# Altium project EMGfrontend.PrjPcb
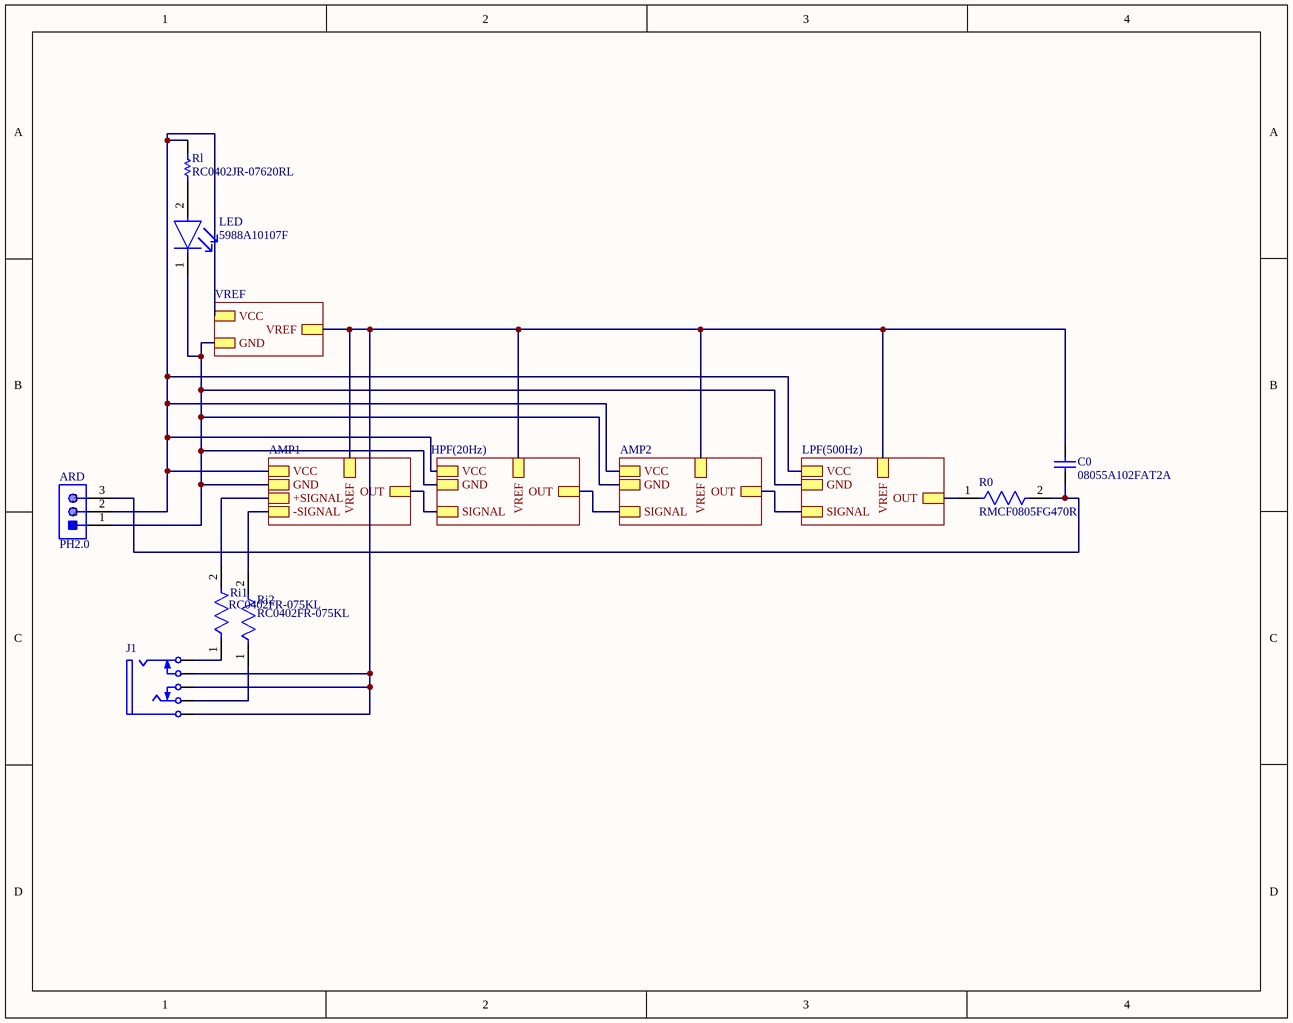
[diagram p0: EMGfrontend.SchDoc]
6 sheets, 29 parts. Net scope: hierarchical (ports join the sheet entries above them; power ports are global).
Board file: EMGfrontend.PcbDoc
Sheets:
  EMGfrontend.SchDoc
    VREF = VREF.SchDoc
    AMP2 = AMP2.SchDoc
    LPF(500Hz) = LPF(500Hz).SchDoc
    AMP1 = AMP1.SchDoc
    HPF(20Hz) = HPF(20Hz).SchDoc

## Sheet EMGfrontend.SchDoc
size A; SheetNumber: 1; SheetTotal: 6

### Parts
ARD  PH2.0  [JST-B3B-PH-K-S-3_V]
C0  08055A102FAT2A  [CAPC2013X94X50NL20T25]
J1  (no value)  [SWIT-35RASMT4BHNTRX_V]
LED  5988A10107F  [FP-5988A10107F-MFG]
R0  RMCF0805FG470R  [FP-RMCF0805-IPC_C]
Ri1  RC0402FR-075KL  [FP-RC0402-MFG]
Ri2  RC0402FR-075KL  [FP-RC0402-MFG]
Rl  RC0402JR-07620RL  [RESC1005X40X25ML05T10]

### Sub-sheets
AMP1 = AMP1.SchDoc: VREF, +SIGNAL, OUT, GND, VCC, -SIGNAL
AMP2 = AMP2.SchDoc: VREF, SIGNAL, VCC, GND, OUT
HPF(20Hz) = HPF(20Hz).SchDoc: SIGNAL, VREF, OUT, VCC, GND
LPF(500Hz) = LPF(500Hz).SchDoc: SIGNAL, VCC, GND, VREF, OUT
VREF = VREF.SchDoc: VREF, VCC, GND

### Nets
NetARD_1: ARD.1 LED.1(C) ; sheet VREF/GND, sheet AMP2/GND, sheet LPF(500Hz)/GND, sheet AMP1/GND, sheet HPF(20Hz)/GND
NetARD_2: ARD.2 Rl.2 ; sheet VREF/VCC, sheet AMP2/VCC, sheet LPF(500Hz)/VCC, sheet AMP1/VCC, sheet HPF(20Hz)/VCC
NetARD_3: ARD.3 C0.1 R0.2
NetC0_2: C0.2 J1.1 J1.4 J1.5 ; sheet VREF/VREF, sheet AMP2/VREF, sheet LPF(500Hz)/VREF, sheet AMP1/VREF, sheet HPF(20Hz)/VREF
NetC3_1: sheet AMP1/OUT, sheet HPF(20Hz)/SIGNAL
NetC4_2: R0.1 ; sheet LPF(500Hz)/OUT
NetJ1_2: J1.2 Ri1.1
NetJ1_3: J1.3 Ri2.1
NetLED_2: LED.2(A) Rl.1
NetR5_2: sheet AMP2/SIGNAL, sheet HPF(20Hz)/OUT
NetR7_2: sheet AMP2/OUT, sheet LPF(500Hz)/SIGNAL
NetRi1_2: Ri1.2 ; sheet AMP1/+SIGNAL
NetRi2_2: Ri2.2 ; sheet AMP1/-SIGNAL

### Library data of the parts
ARD = CMP-2000-05164-1: Male Header, Pitch 2 mm, 1 x 3 Position, Height 6 mm, Tail Length 3.4 mm, -25 to 85 degC, RoHS, Bulk; Manufacturer: JST; Style/Orientation: StraightHeader/Plug; Pitch: 2mm; No of Positions: 3; Termination: Crimp; Manufacturer URL: http://www.jst.com/home2.html; Datasheet Version: Oct-06; Type: ShroudedHeader; Datasheet URL: https://datasheet.ciiva.com/11746/0900766b80826550-11746939.pdf
C0 = CMP-2007-04267-1: Manufacturer: AVX Interconnect / Elco; Part Number: 08055A102FAT2A
J1 = CMP-1772-00001-1: Female 3.5 mm Phone Jack, 5 Position, Height 5 mm, RoHS, Tape and Reel; Current Rating: 50 mA; Voltage Rating (DC): 12 V; ComponentLink1URL: http://www.switchcraft.com/; ComponentLink2Description: Datasheet; ComponentLink2URL: http://www.switchcraft.com/Drawings/35rasmt4bhntrx_cd.pdf; PackageDescription: Female 3.5 mm Phone Jack, 5 Position, Height 5 mm; PackageReference: 35RASMT4BHNTRX; Mount: Through Hole; DatasheetVersion: Rev. C, 07/2014; Contact Material: Silver; ComponentLink1Description: Manufacturer URL; Packaging: Tape and Reel; RoHSCompliant: true; Contact Plating: Silver; Package Quantity: 3000
LED = CMP-00106-100993512-1: 5988A10107F LED Uni-Color Red 2-Pin Chip 0402(1006Metric) T/R; Forward Voltage: 1.6V; Forward Current: 5mA; Power Dissipation: 46mW; Reverse Voltage: 5V; Luminous Intensity: 65mcd; Viewing Angle: 140°; Wavelength: 635nm; Max Operating Temperature: 85°C; Case/Package: 0402; Color: Red; Height: 533.4µm; NexarPartId: 100993512; RoHS: Compliant; Schedule B: 8541402000, 8541402000; Min Operating Temperature: -40°C
R0 = CMP-26527-003746-1: 470Ω ±1% 0.125W 0805 Thick Film Chip Resistor AEC-Q200 compliant; Resistance: 470R; Temperature Coefficient: 100ppm/°C; Max Power Dissipation: 125mW; Resistor Type: Thick Film; Number of Terminations: 2; Packaging: Tape and Reel; RoHS Compliant: Yes; Case/Package: 0805; Mount: Surface Mount; Contact Plating: Tin; Series: RMCF; Min Operating Temperature: -55°C; Radiation Hardening: No; Features: Automotive AEC-Q200; Tolerance: 1%; Max Operating Temperature: 155°C
Ri1 Ri2 = CMP-03412-013078-1: RES SMD 5K OHM 1% 1/16W 0402; Manufacturer: Yageo; Resistance: 5kΩ; Temperature Coefficient: 100ppm/°C; Power Rating: 0.0625W; Voltage Rating: 50V; Value: 5kΩ; Temperature Range Low: -55°C; Lead Free: Yes; RoHS: TRUE; Device Class L2: Resistors; Package: RC0402; Footprint Url: https://pccomponents.com/datasheets/YAGEO-20RESISTORS.PDF; Height: 0.4mm; ComponentLink2URL: http://www.yageo.com/documents/recent/PYu-RC_Group_51_RoHS_L_10.pdf; Temperature: -55°C to +155°C; Composition: Thick Film; Device Class L1: Passive Components; Series: RC_L; Ipc Land Pattern Name: RESC10050X35; Tolerance: 1%; Device Class L3: Chip SMD Resistors; Temperature Range High: +155°C; Category: Res; Automotive: No; Octopart: https://octopart.com/rc0402fr-075kl-yageo-25450038; Digikey Description: RES SMD 5K OHM 1% 1/16W 0402; ComponentLink2Description: Datasheet; Manufacturer Part Number: RC0402FR-075KL
Rl = CMP-2002-07079-1: Manufacturer: Yageo / Phycomp; Part Number: RC0402JR-07620RL

## Sheet VREF.SchDoc
size A; SheetNumber: 2; SheetTotal: 6
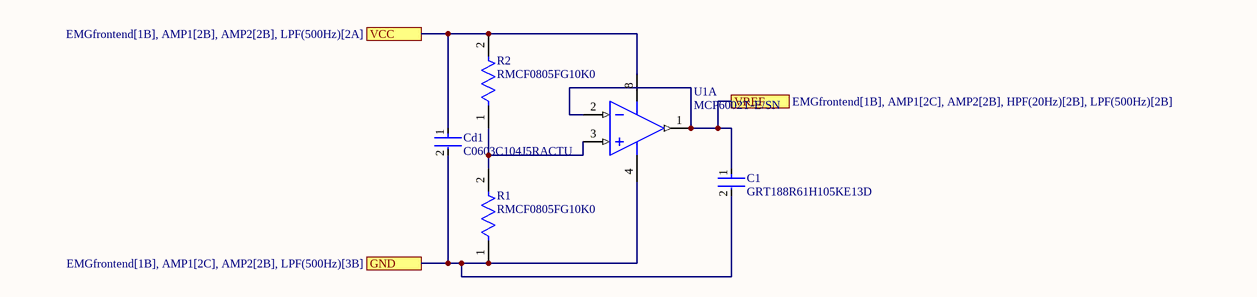
[diagram p1: VREF.SchDoc]

### Parts
C1  GRT188R61H105KE13D  [FP-GRT188-0_1-e0_2_0_5-IPC_B]
Cd1  C0603C104J5RACTU  [FP-C0603C-CF-MFG]
R1  RMCF0805FG10K0  [FP-RMCF0805-IPC_A]
R2  RMCF0805FG10K0  [FP-RMCF0805-IPC_A]
U1  MCP6002T-E/SN  [SOIC-SN8_N]  (part A of 2)

### Ports
GND (see EMGfrontend[1B], AMP1[2C], AMP2[2B], LPF(500Hz)[3B]), VCC (see EMGfrontend[1B], AMP1[2B], AMP2[2B], LPF(500Hz)[2A]), VREF (see EMGfrontend[1B], AMP1[2C], AMP2[2B], HPF(20Hz)[2B], LPF(500Hz)[2B])

### Nets
NetARD_1: C1.2 Cd1.2 R1.1 U1.4(VSS) ; port GND
NetARD_2: Cd1.1 R2.2 U1.8(VDD) ; port VCC
NetC0_2: C1.1 U1.1(VOUTA) U1.2(VINA-) ; port VREF
NetR1_2: R1.2 R2.1 U1.3(VINA+)

### Library data of the parts
C1 = CMP-06035-031856-1: Multi-Layer Ceramic Capacitor 1uF 50V X5R ±10% 0603 Paper T/R; Voltage Rating (DC): 50V; Voltage Rating: 50V; Min Operating Temperature: -55°C; Case Code (Metric): 1608; Thickness: 0.035inch; Width: 0.031inch; Capacitance: 1uF; Tolerance: 10%; Max Operating Temperature: 85°C; Dielectric: X5R; Case Code (Imperial): 0603; Case/Package: 0603; Length: 0.063inch; Packaging: Tape and Reel; Mount: Surface Mount; Ratings: AEC-Q200
Cd1 = CMP-2006-03056-2: CAP CER 0.1UF 50V 5% X7R 0603; Manufacturer: KEMET; Automotive Grade: Grade 1; Tolerance: 0.05; Capacitance: 0.10 μF; Value: 0.10 μF; Temperature Coefficient: 30ppm/°C; ComponentLink2Description: Datasheet; Voltage Rating: 50 V; Digikey Description: CAP CER 0.1UF 50V 5% X7R 0603; Manufacturer Part Number: C0603C104J5RACTU; Temperature Range High: +125°C; Device Class L2: Capacitors; Octopart: https://octopart.com/c0603c104j5ractu-kemet-10440638; RoHS: TRUE; Mouser Description: Multilayer Ceramic Capacitors MLCC - SMD/SMT 50volts 0.1uF X7R 5%; Temperature Range Low: -55°C; Automotive: Yes; Lead Free: Yes; ComponentLink2URL: https://api.kemet.com/component-edge/download/datasheet/C0603C100J5GACAUTO.pdf; Material: Ceramic; Device Class L3: Ceramic Capacitors; Package: C0603C-CF; Category: Cap; Temperature: -55°C to +125°C; Height: 0.87mm; Temperature Characteristic: X7R; Device Class L1: Passive Components
R1 R2 = CMP-26527-002739-1: 10kΩ ±1% 0.125W 0805 Thick Film Chip Resistor AEC-Q200 compliant; Resistance: 10kR; Max Power Dissipation: 125mW; Temperature Coefficient: 100ppm/°C; Construction: Rectangular; Case/Package: 0805; Contact Plating: Tin; RoHS Compliant: Yes; Mount: Surface Mount; Case Code (Metric): 2012; Radiation Hardening: No; Packaging: Tape and Reel; Case Code (Imperial): 0805; Tolerance: 1%; Max Operating Temperature: 155°C; Length: 0.079inch; Min Operating Temperature: -55°C; Features: Automotive AEC-Q200; Width: 0.049inch; Height: 0.026inch; Depth: 1.25mm; Number of Terminations: 2; Resistor Type: Thick Film; Series: RMCF; Military Standard: Not
U1 = CMP-0187-00363-3: None; Nominal Supply Current: 100uA; Operating Supply Voltage: 5.5V; Input Bias Current: 1pA; Output Current per Channel: 23mA; Unity Gain Bandwidth Product: 1MHz; Number of Elements: 2; Power Supply Rejection Ratio (PSRR): 86dB; Slew Rate: 0.6V/µs; Min Supply Voltage: 1.8V; Voltage Gain: 112dB; Max Supply Voltage: 6V; Input Offset Voltage (Vos): 4.5mV; Common Mode Rejection Ratio: 60dB; Amplifier Type: GENERAL PURPOSE; Technology: CMOS; Output Current: 23mA; Number of Pins: 8; Lead Free: Lead Free; Number of Channels: 2; Package Quantity: 3300; Max Operating Temperature: 125°C; Number of Circuits: 2; Supply Current: 100uA; Gain Bandwidth Product: 1MHz; Min Operating Temperature: -40°C; Series: -; Mount: Surface Mount; Case/Package: SOIC; Radiation Hardening: No; Packaging: Tape and Reel; Operating Supply Current: 100uA; RoHS Compliant: Yes

## Sheet AMP2.SchDoc
size A; SheetNumber: 5; SheetTotal: 6
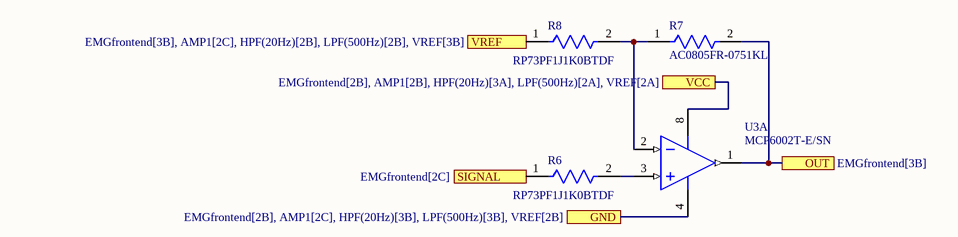
[diagram p2: AMP2.SchDoc]

### Parts
R6  RP73PF1J1K0BTDF  [FP-RP73P-1J-MFG]
R7  AC0805FR-0751KL  [FP-AC0805-MFG]
R8  RP73PF1J1K0BTDF  [FP-RP73P-1J-MFG]
U3  MCP6002T-E/SN  [SOIC-SN8_N]  (part A of 2)

### Ports
GND (see EMGfrontend[2B], AMP1[2C], HPF(20Hz)[3B], LPF(500Hz)[3B], VREF[2B]), OUT (see EMGfrontend[3B]), SIGNAL (see EMGfrontend[2C]), VCC (see EMGfrontend[2B], AMP1[2B], HPF(20Hz)[3A], LPF(500Hz)[2A], VREF[2A]), VREF (see EMGfrontend[3B], AMP1[2C], HPF(20Hz)[2B], LPF(500Hz)[2B], VREF[3B])

### Nets
NetARD_1: U3.4(VSS) ; port GND
NetARD_2: U3.8(VDD) ; port VCC
NetC0_2: R8.1 ; port VREF
NetR5_2: R6.1 ; port SIGNAL
NetR6_2: R6.2 U3.3(VINA+)
NetR7_1: R7.1 R8.2 U3.2(VINA-)
NetR7_2: R7.2 U3.1(VOUTA) ; port OUT

### Library data of the parts
R6 R8 = CMP-03211-004517-1: RES SMD 1K OHM 0.1% 1/6W 0603; Manufacturer: TE Connectivity; Value: 1KΩ; Power Rating: 0.166W; Tolerance: 0.001; Temperature Coefficient: 25ppm/°C; Description: RP73P 0603 1KΩ 0.166W 25ppm/°C 0.10% 100V; Voltage Rating: 100V; Composition: Thin Film; Category: Res; Temperature Range High: +155°C; Device Class L1: Passive Components; Digikey Description: RES SMD 1K OHM 0.1% 1/6W 0603; Lead Free: Yes; RoHS: TRUE; Ipc Land Pattern Name: RESC15580X45; Automotive: No; Temperature: -55°C to +155°C; Height: 0.55mm; ComponentLink2URL: https://www.te.com/commerce/DocumentDelivery/DDEController?Action=srchrtrv&DocNm=1773272&DocType=DS&DocLang=English; Manufacturer Part Number: RP73PF1J1K0BTDF; Resistance: 1KΩ; ComponentLink2Description: Datasheet; Temperature Range Low: -55°C; Octopart: https://octopart.com/rp73pf1j1k0btdf-te+connectivity-45465729; Device Class L3: Chip SMD Resistors; Series: RP73P; Package: RP73P-1J; Device Class L2: Resistors
R7 = CMP-03412-037324-1: RES SMD 51K OHM 1% 1/8W 0805; Manufacturer: Yageo; Voltage Rating: 150V; Automotive Grade: Grade 0; Resistance: 51KΩ; Tolerance: 0.01; Value: 51KΩ; Device Class L3: Chip SMD Resistors; Category: Res; Composition: Thick Film; Device Class L1: Passive Components; ComponentLink2Description: Datasheet; Manufacturer Part Number: AC0805FR-0751KL; Temperature: -55°C to +155°C; Height: 0.6mm; Package: AC0805; ComponentLink2URL: http://www.yageo.com/documents/recent/PYu-AC_51_RoHS_L_6.pdf; Mouser Description: Thick Film Resistors - SMD 1/8W 51K ohm 1%; Lead Free: Yes; Digikey Description: RES SMD 51K OHM 1% 1/8W 0805; RoHS: TRUE; Device Class L2: Resistors; Octopart: https://octopart.com/ac0805fr-0751kl-yageo-24874955; Ipc Land Pattern Name: RESC200125X50; Temperature Range Low: -55°C; Footprint Url: http://www.yageo.com/exep/pages/download/literatures/PYu-R_Mount_10.pdf; Series: AC; Automotive: Yes; Power Rating: 1/8W; Temperature Range High: +155°C
U3 = CMP-0187-00363-3: as U1 on sheet VREF; Technology: CMOS; Output Current: 23mA; Number of Pins: 8; Lead Free: Lead Free; Number of Channels: 2; Package Quantity: 3300; Max Operating Temperature: 125°C; Number of Circuits: 2; Supply Current: 100uA; Gain Bandwidth Product: 1MHz; Min Operating Temperature: -40°C; Series: -; Mount: Surface Mount; Case/Package: SOIC; Radiation Hardening: No; Packaging: Tape and Reel; Operating Supply Current: 100uA; RoHS Compliant: Yes

## Sheet LPF(500Hz).SchDoc
size A; SheetNumber: 6; SheetTotal: 6
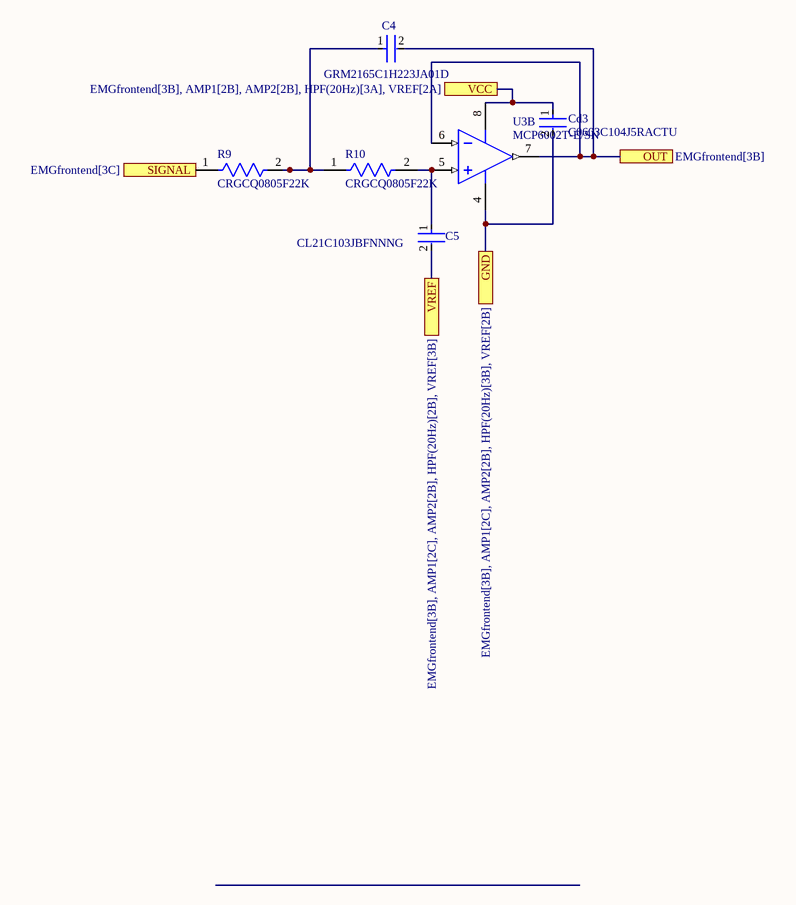
[diagram p3: LPF(500Hz).SchDoc]

### Parts
C4  GRM2165C1H223JA01D  [FP-GRM216-0_1-0_05-MFG]
C5  CL21C103JBFNNNG  [FP-CL21-IPC_B]
Cd3  C0603C104J5RACTU  [FP-C0603C-CF-MFG]
R9  CRGCQ0805F22K  [FP-CRGCQ0805-IPC_C]
R10  CRGCQ0805F22K  [FP-CRGCQ0805-IPC_C]
U3  MCP6002T-E/SN  [SOIC-SN8_N]  (part B of 2)

### Ports
GND (see EMGfrontend[3B], AMP1[2C], AMP2[2B], HPF(20Hz)[3B], VREF[2B]), OUT (see EMGfrontend[3B]), SIGNAL (see EMGfrontend[3C]), VCC (see EMGfrontend[3B], AMP1[2B], AMP2[2B], HPF(20Hz)[3A], VREF[2A]), VREF (see EMGfrontend[3B], AMP1[2C], AMP2[2B], HPF(20Hz)[2B], VREF[3B])

### Nets
NetARD_1: Cd3.2 U3.4(VSS) ; port GND
NetARD_2: Cd3.1 U3.8(VDD) ; port VCC
NetC0_2: C5.2 ; port VREF
NetC4_1: C4.1 R9.2 R10.1
NetC4_2: C4.2 U3.6(VINB-) U3.7(VOUTB) ; port OUT
NetC5_1: C5.1 R10.2 U3.5(VINB+)
NetR7_2: R9.1 ; port SIGNAL

### Library data of the parts
C4 = CMP-06035-050815-1: 22000pF
C5 = CMP-13271-003702-1: 10nF; Voltage Rating: 50V; Dielectric: C0G; Tolerance: 5%; Temperature Coefficient: 300ppm/°C; Packaging: Tape and Reel; Package Quantity: 3000; Case Code (Imperial): 0805; Mount: Surface Mount; Max Operating Temperature: 125°C; Case Code (Metric): 2012; Width: 0.049inch; Thickness: 0.053inch; Depth: 1.25mm; Case/Package: 0805; Capacitance: 10nF; Min Operating Temperature: -55°C; Voltage: 50V; Length: 2mm; Height: 1.25mm; Radiation Hardening: No
Cd3 = CMP-2006-03056-2: as Cd1 on sheet VREF; ComponentLink2Description: Datasheet; Voltage Rating: 50 V; Digikey Description: CAP CER 0.1UF 50V 5% X7R 0603; Manufacturer Part Number: C0603C104J5RACTU; Temperature Range High: +125°C; Device Class L2: Capacitors; Octopart: https://octopart.com/c0603c104j5ractu-kemet-10440638; RoHS: TRUE; Mouser Description: Multilayer Ceramic Capacitors MLCC - SMD/SMT 50volts 0.1uF X7R 5%; Temperature Range Low: -55°C; Automotive: Yes; Lead Free: Yes; ComponentLink2URL: https://api.kemet.com/component-edge/download/datasheet/C0603C100J5GACAUTO.pdf; Material: Ceramic; Device Class L3: Ceramic Capacitors; Package: C0603C-CF; Category: Cap; Temperature: -55°C to +125°C; Height: 0.87mm; Temperature Characteristic: X7R; Device Class L1: Passive Components
R9 R10 = CMP-03211-003824-1: CRGCQ0805 22KΩ 0.125W ±100ppm/°C 1% 150V; Manufacturer: TE Connectivity; Automotive Grade: Grade 985; Tolerance: 0.01; Temperature Coefficient: ±100ppm/°C; Octopart: https://octopart.com/crgcq0805f22k-te+connectivity-91018161; Manufacturer Part Number: CRGCQ0805F22K; Power Rating: 0.125W; Series: CRGCQ; Device Class L1: Passive Components; Composition: Thick Film; Lead Free: Yes; Ipc Land Pattern Name: RESC200125X55; ComponentLink2URL: https://www.te.com/commerce/DocumentDelivery/DDEController?Action=showdoc&DocId=Data+Sheet%7F1773204-3%7F1%7Fpdf%7FEnglish%7FENG_DS_1773204-3_1.pdf%7F4-2176341-994; Device Class L3: Chip SMD Resistors; Package: CRGCQ0805; Temperature Range Low: -55°C; Voltage Rating: 150V; Value: 22KΩ; Temperature: -55°C to +155°C; ComponentLink2Description: Datasheet; Automotive: Yes; Height: 0.65mm; Device Class L2: Resistors; RoHS: TRUE; Ambient Temperature Range High: +70°C; Temperature Range High: +155°C; Resistance: 22KΩ; Category: Res
U3 = CMP-0187-00363-3: as U1 on sheet VREF; Technology: CMOS; Output Current: 23mA; Number of Pins: 8; Lead Free: Lead Free; Number of Channels: 2; Package Quantity: 3300; Max Operating Temperature: 125°C; Number of Circuits: 2; Supply Current: 100uA; Gain Bandwidth Product: 1MHz; Min Operating Temperature: -40°C; Series: -; Mount: Surface Mount; Case/Package: SOIC; Radiation Hardening: No; Packaging: Tape and Reel; Operating Supply Current: 100uA; RoHS Compliant: Yes

## Sheet AMP1.SchDoc
size A; SheetNumber: 3; SheetTotal: 6
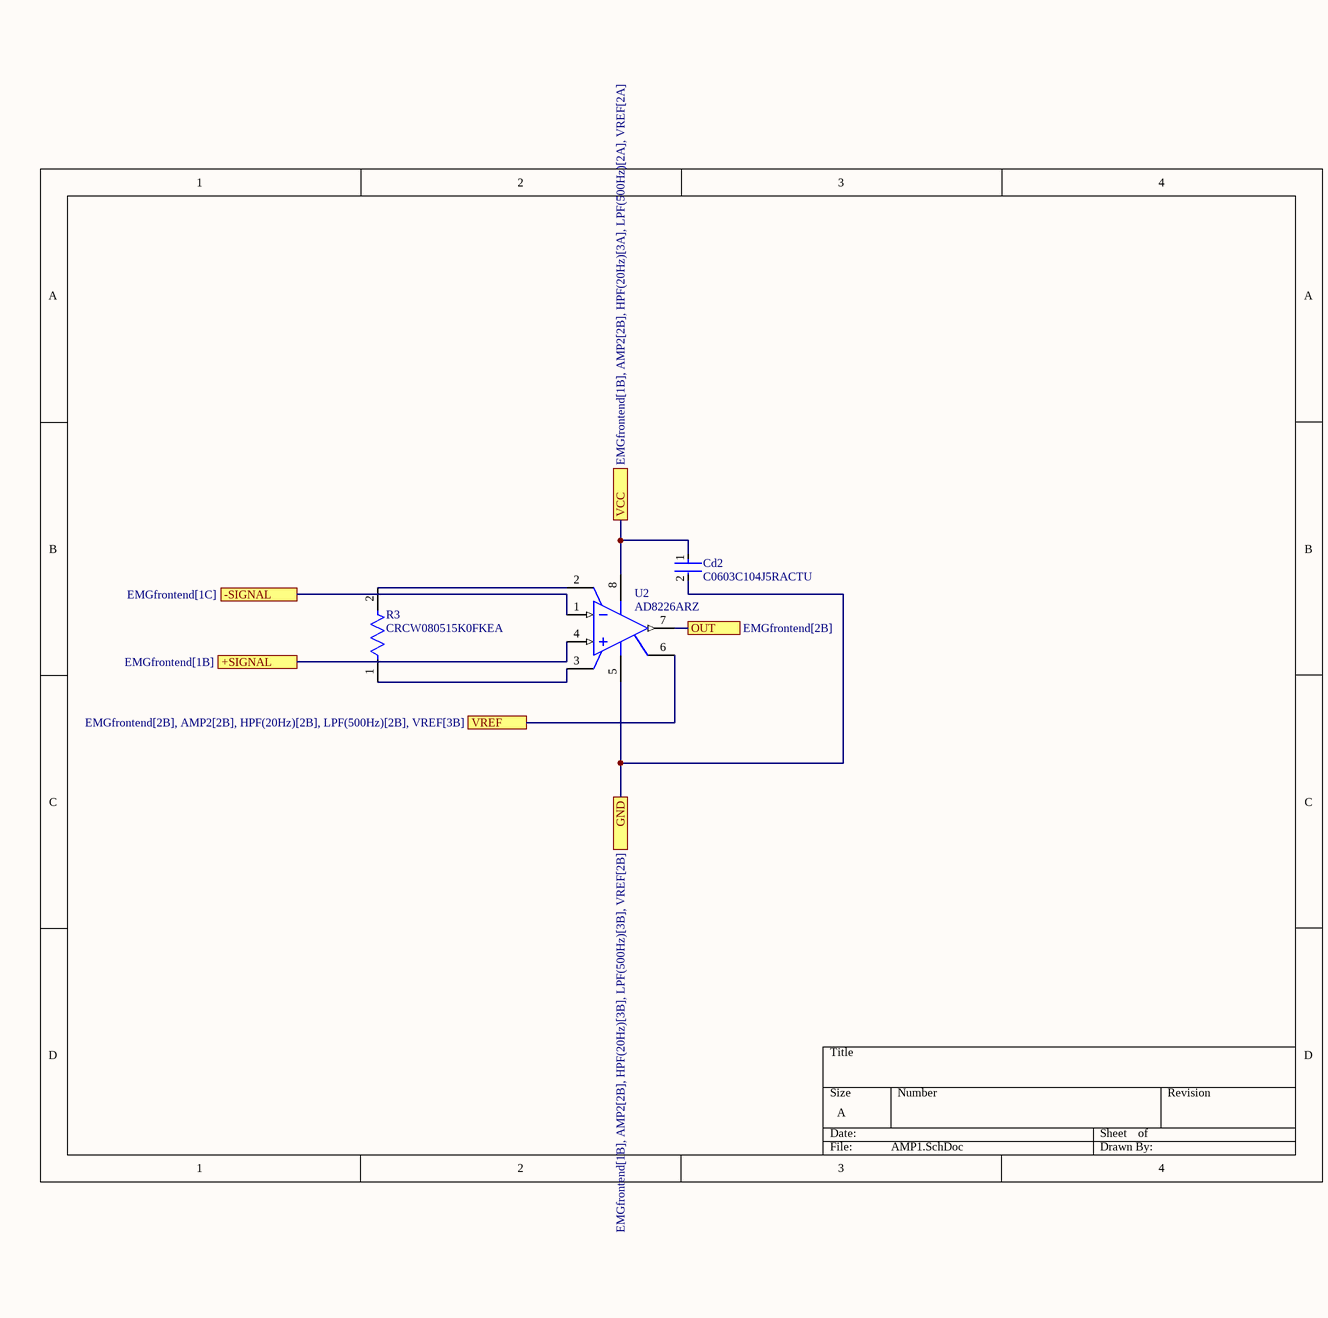
[diagram p4: AMP1.SchDoc]

### Parts
Cd2  C0603C104J5RACTU  [FP-C0603C-CF-MFG]
R3  CRCW080515K0FKEA  [FP-CRCW0805-e3-IPC_C]
U2  AD8226ARZ  [ADI-R-8_L]

### Ports
+SIGNAL (see EMGfrontend[1B]), -SIGNAL (see EMGfrontend[1C]), GND (see EMGfrontend[1B], AMP2[2B], HPF(20Hz)[3B], LPF(500Hz)[3B], VREF[2B]), OUT (see EMGfrontend[2B]), VCC (see EMGfrontend[1B], AMP2[2B], HPF(20Hz)[3A], LPF(500Hz)[2A], VREF[2A]), VREF (see EMGfrontend[2B], AMP2[2B], HPF(20Hz)[2B], LPF(500Hz)[2B], VREF[3B])

### Nets
NetARD_1: Cd2.2 U2.5(-VS) ; port GND
NetARD_2: Cd2.1 U2.8(+VS) ; port VCC
NetC0_2: U2.6(REF) ; port VREF
NetC3_1: U2.7(VOUT) ; port OUT
NetR3_1: R3.1 U2.3(RG)
NetR3_2: R3.2 U2.2(RG)
NetRi1_2: U2.4(+IN) ; port +SIGNAL
NetRi2_2: U2.1(-IN) ; port -SIGNAL

### Library data of the parts
Cd2 = CMP-2006-03056-2: as Cd1 on sheet VREF; ComponentLink2Description: Datasheet; Voltage Rating: 50 V; Digikey Description: CAP CER 0.1UF 50V 5% X7R 0603; Manufacturer Part Number: C0603C104J5RACTU; Temperature Range High: +125°C; Device Class L2: Capacitors; Octopart: https://octopart.com/c0603c104j5ractu-kemet-10440638; RoHS: TRUE; Mouser Description: Multilayer Ceramic Capacitors MLCC - SMD/SMT 50volts 0.1uF X7R 5%; Temperature Range Low: -55°C; Automotive: Yes; Lead Free: Yes; ComponentLink2URL: https://api.kemet.com/component-edge/download/datasheet/C0603C100J5GACAUTO.pdf; Material: Ceramic; Device Class L3: Ceramic Capacitors; Package: C0603C-CF; Category: Cap; Temperature: -55°C to +125°C; Height: 0.87mm; Temperature Characteristic: X7R; Device Class L1: Passive Components
R3 = CMP-2001-04967-2: RES Thick Film, 15kΩ, 1%, 0.125W, 100ppm/°C, 0805; Power Rating: 125mW; Voltage Rating: 150V; Resistance: 15kR; Height: 0.45mm; Number of Terminations: 2; Composition: Thick Film; Length: 2mm; Case/Package: 0805; Depth: 1.25mm; Min Operating Temperature: -55°C; Lead Free: Lead Free; Mount: Surface Mount; Package Quantity: 10; Termination: SMD/SMT; Packaging: Tape and Reel; Case Code (Metric): 2012; Features: Automotive AEC-Q200; Military Standard: Not; Width: 0.049inch; Temperature Coefficient: 100ppm/°C; Max Power Dissipation: 125mW; Weight: 0.000194oz; Tolerance: 1%; Voltage Rating (DC): 150V; Max Operating Temperature: 155°C; Radiation Hardening: No; Contact Plating: Tin; Case Code (Imperial): 0805
U2 = CMP-2000-05749-1: Wide Supply Range, Rail-to-Rail Output Instrumentation Amplifier, 2.2 to 36 V, -40 to 125 degC, 8-Pin SOIC (R-8), RoHS, Tube; Manufacturer: Analog Devices; PCN Design/Specification: PolyimideAlignmentTarget11/Aug/2015; Mfg Application Notes: AutomaticExternalDefibrillator(AED)SolutionsElectromagneticFlowMeterSolutionsMotorControlSolution—ServoControlProgrammableLogicControllers(PLCs)SolutionsElectrocardiogram(ECG)Solutions; EDA / CAD Models: DownloadfromAcceleratedDesigns; Design Resources: PLCandDCSUniversalAnalogInputUsingEither4or6-PinTerminalBlock; Current - Input Bias: 20nA; Product Training Modules: CommonPhotodiodeOp-AmpCircuitProblemsandSolutionsIndirectCurrentFeedbackInstrumentationAmplifierApplicationsGuide; -3db Bandwidth: 1.5MHz; Number of Circuits: 1; Current - Supply: 350µA; Current - Output / Channel: 13mA; Voltage - Input Offset: 100µV; Slew Rate: 0.6V/µs; Voltage - Supply, Single/Dual (±): 2.2V~36V,±1.35V~18V; Online Catalog: Instrumentation; Output Type: Rail-to-Rail; Mounting Type: SurfaceMount; Datasheet Version: Rev. C, 09/2012; Series: -; Category: IntegratedCircuits(ICs); Datasheet URL: http://www.analog.com/media/en/technical-documentation/data-sheets/AD8226.pdf; Mounting Technology: SurfaceMount; Standard Package: 98; Package / Case: 8-SOIC(0.154",3.90mmWidth); Package Description: 8-Pin Small Outline Package, Body 4.9 x 3.9 mm, Pitch 1.27 mm; Operating Temperature: -40°C~125°C; Gain Bandwidth Product: -; Manufacturer URL: http://www.analog.com/; Family: Linear-Amplifiers-Instrumentation,OPAmps,BufferAmps; Supplier Device Package: 8-SOIC; Package Reference: R-8; Amplifier Type: Instrumentation; Packaging: Tube

## Sheet HPF(20Hz).SchDoc
size A; SheetNumber: 4; SheetTotal: 6
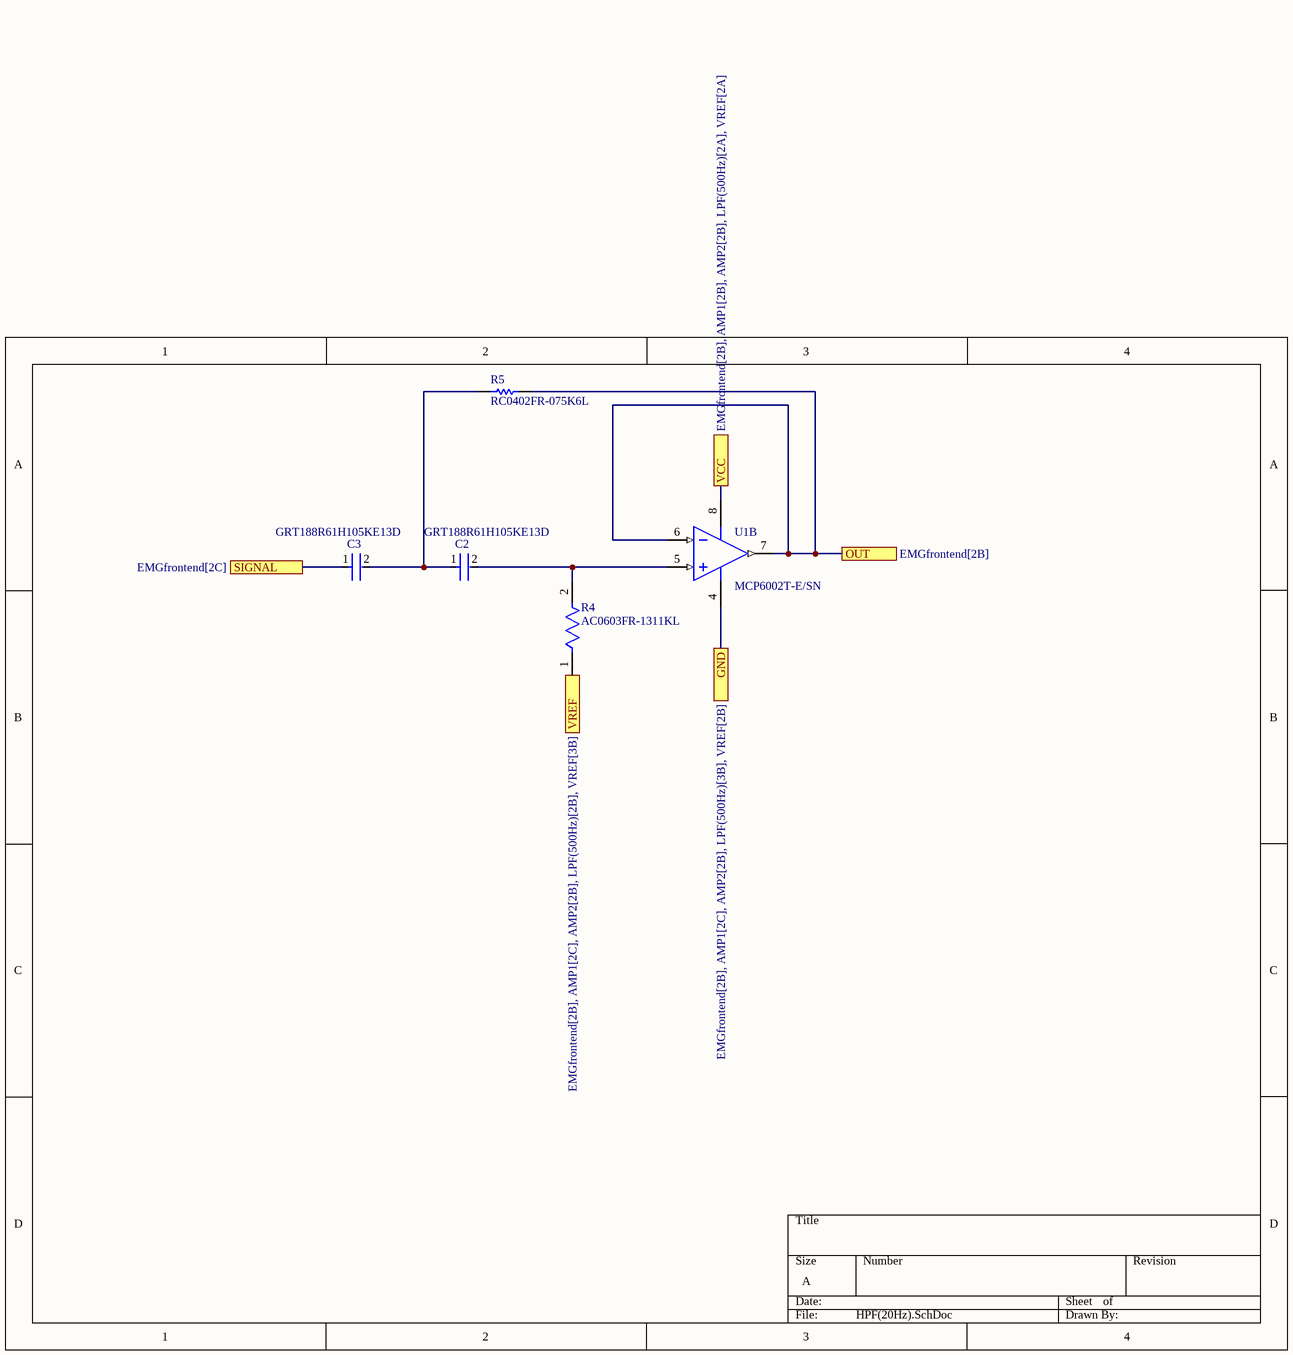
[diagram p5: HPF(20Hz).SchDoc]

### Parts
C2  GRT188R61H105KE13D  [FP-GRT188-0_1-e0_2_0_5-IPC_B]
C3  GRT188R61H105KE13D  [FP-GRT188-0_1-e0_2_0_5-IPC_B]
R4  AC0603FR-1311KL  [FP-AC0603-IPC_B]
R5  RC0402FR-075K6L  [RESC1005X40X25LL05T10]
U1  MCP6002T-E/SN  [SOIC-SN8_N]  (part B of 2)

### Ports
GND (see EMGfrontend[2B], AMP1[2C], AMP2[2B], LPF(500Hz)[3B], VREF[2B]), OUT (see EMGfrontend[2B]), SIGNAL (see EMGfrontend[2C]), VCC (see EMGfrontend[2B], AMP1[2B], AMP2[2B], LPF(500Hz)[2A], VREF[2A]), VREF (see EMGfrontend[2B], AMP1[2C], AMP2[2B], LPF(500Hz)[2B], VREF[3B])

### Nets
NetARD_1: U1.4(VSS) ; port GND
NetARD_2: U1.8(VDD) ; port VCC
NetC0_2: R4.1 ; port VREF
NetC2_1: C2.1 C3.2 R5.1
NetC2_2: C2.2 R4.2 U1.5(VINB+)
NetC3_1: C3.1 ; port SIGNAL
NetR5_2: R5.2 U1.6(VINB-) U1.7(VOUTB) ; port OUT

### Library data of the parts
C2 C3 = CMP-06035-031856-1: as C1 on sheet VREF; Voltage Rating (DC): 50V; Voltage Rating: 50V; Min Operating Temperature: -55°C; Case Code (Metric): 1608; Thickness: 0.035inch; Width: 0.031inch; Capacitance: 1uF; Tolerance: 10%; Max Operating Temperature: 85°C; Dielectric: X5R; Case Code (Imperial): 0603; Case/Package: 0603; Length: 0.063inch; Packaging: Tape and Reel; Mount: Surface Mount; Ratings: AEC-Q200
R4 = CMP-03412-047641-1: RES 11KΩ 1.00% 0.1W 0603; RoHS Compliant: Yes
R5 = CMP-2002-07756-1: Manufacturer: Yageo / Phycomp; Part Number: RC0402FR-075K6L
U1 = CMP-0187-00363-3: as U1 on sheet VREF; Technology: CMOS; Output Current: 23mA; Number of Pins: 8; Lead Free: Lead Free; Number of Channels: 2; Package Quantity: 3300; Max Operating Temperature: 125°C; Number of Circuits: 2; Supply Current: 100uA; Gain Bandwidth Product: 1MHz; Min Operating Temperature: -40°C; Series: -; Mount: Surface Mount; Case/Package: SOIC; Radiation Hardening: No; Packaging: Tape and Reel; Operating Supply Current: 100uA; RoHS Compliant: Yes

## Nets that join several sheets
NetARD_1: EMGfrontend (ARD.1 LED.1), VREF (C1.2 Cd1.2 R1.1 U1.4), AMP2 (U3.4), LPF(500Hz) (Cd3.2 U3.4), AMP1 (Cd2.2 U2.5), HPF(20Hz) (U1.4)
NetARD_2: EMGfrontend (ARD.2 Rl.2), VREF (Cd1.1 R2.2 U1.8), AMP2 (U3.8), LPF(500Hz) (Cd3.1 U3.8), AMP1 (Cd2.1 U2.8), HPF(20Hz) (U1.8)
NetC0_2: EMGfrontend (C0.2 J1.1 J1.4 J1.5), VREF (C1.1 U1.1 U1.2), AMP2 (R8.1), LPF(500Hz) (C5.2), AMP1 (U2.6), HPF(20Hz) (R4.1)
NetC3_1: AMP1 (U2.7), HPF(20Hz) (C3.1)
NetC4_2: EMGfrontend (R0.1), LPF(500Hz) (C4.2 U3.6 U3.7)
NetR5_2: AMP2 (R6.1), HPF(20Hz) (R5.2 U1.6 U1.7)
NetR7_2: AMP2 (R7.2 U3.1), LPF(500Hz) (R9.1)
NetRi1_2: EMGfrontend (Ri1.2), AMP1 (U2.4)
NetRi2_2: EMGfrontend (Ri2.2), AMP1 (U2.1)